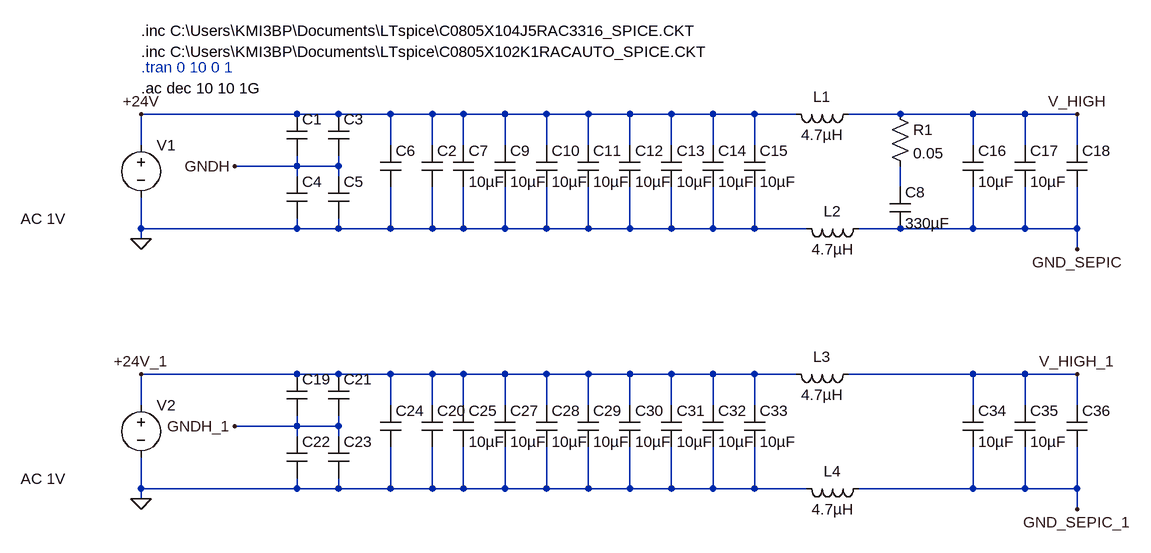
[diagram p0: schematic Draft1.asc]
Draft1.asc, the LTspice schematic file:
Version 4
SHEET 1 1584 900
WIRE 304 80 64 80
WIRE 368 80 304 80
WIRE 448 80 368 80
WIRE 512 80 448 80
WIRE 560 80 512 80
WIRE 624 80 560 80
WIRE 688 80 624 80
WIRE 752 80 688 80
WIRE 816 80 752 80
WIRE 880 80 816 80
WIRE 944 80 880 80
WIRE 1008 80 944 80
WIRE 1072 80 1008 80
WIRE 1232 80 1152 80
WIRE 1344 80 1232 80
WIRE 1424 80 1344 80
WIRE 1504 80 1424 80
WIRE 64 128 64 80
WIRE 448 128 448 80
WIRE 512 128 512 80
WIRE 560 128 560 80
WIRE 624 128 624 80
WIRE 688 128 688 80
WIRE 752 128 752 80
WIRE 816 128 816 80
WIRE 880 128 880 80
WIRE 944 128 944 80
WIRE 1008 128 1008 80
WIRE 1344 128 1344 80
WIRE 1424 128 1424 80
WIRE 1504 128 1504 80
WIRE 304 160 304 144
WIRE 304 160 208 160
WIRE 368 160 368 144
WIRE 368 160 304 160
WIRE 304 176 304 160
WIRE 368 176 368 160
WIRE 1232 192 1232 160
WIRE 64 256 64 208
WIRE 304 256 304 240
WIRE 304 256 64 256
WIRE 368 256 368 240
WIRE 368 256 304 256
WIRE 448 256 448 192
WIRE 448 256 368 256
WIRE 512 256 512 192
WIRE 512 256 448 256
WIRE 560 256 560 192
WIRE 560 256 512 256
WIRE 624 256 624 192
WIRE 624 256 560 256
WIRE 688 256 688 192
WIRE 688 256 624 256
WIRE 752 256 752 192
WIRE 752 256 688 256
WIRE 816 256 816 192
WIRE 816 256 752 256
WIRE 880 256 880 192
WIRE 880 256 816 256
WIRE 944 256 944 192
WIRE 944 256 880 256
WIRE 1008 256 1008 192
WIRE 1008 256 944 256
WIRE 1088 256 1008 256
WIRE 1232 256 1168 256
WIRE 1344 256 1344 192
WIRE 1344 256 1232 256
WIRE 1424 256 1424 192
WIRE 1424 256 1344 256
WIRE 1504 256 1504 192
WIRE 1504 256 1424 256
WIRE 64 272 64 256
WIRE 1504 288 1504 256
WIRE 304 480 64 480
WIRE 368 480 304 480
WIRE 448 480 368 480
WIRE 512 480 448 480
WIRE 560 480 512 480
WIRE 624 480 560 480
WIRE 688 480 624 480
WIRE 752 480 688 480
WIRE 816 480 752 480
WIRE 880 480 816 480
WIRE 944 480 880 480
WIRE 1008 480 944 480
WIRE 1072 480 1008 480
WIRE 1344 480 1152 480
WIRE 1424 480 1344 480
WIRE 1504 480 1424 480
WIRE 64 528 64 480
WIRE 448 528 448 480
WIRE 512 528 512 480
WIRE 560 528 560 480
WIRE 624 528 624 480
WIRE 688 528 688 480
WIRE 752 528 752 480
WIRE 816 528 816 480
WIRE 880 528 880 480
WIRE 944 528 944 480
WIRE 1008 528 1008 480
WIRE 1344 528 1344 480
WIRE 1424 528 1424 480
WIRE 1504 528 1504 480
WIRE 304 560 304 544
WIRE 304 560 208 560
WIRE 368 560 368 544
WIRE 368 560 304 560
WIRE 304 576 304 560
WIRE 368 576 368 560
WIRE 64 656 64 608
WIRE 304 656 304 640
WIRE 304 656 64 656
WIRE 368 656 368 640
WIRE 368 656 304 656
WIRE 448 656 448 592
WIRE 448 656 368 656
WIRE 512 656 512 592
WIRE 512 656 448 656
WIRE 560 656 560 592
WIRE 560 656 512 656
WIRE 624 656 624 592
WIRE 624 656 560 656
WIRE 688 656 688 592
WIRE 688 656 624 656
WIRE 752 656 752 592
WIRE 752 656 688 656
WIRE 816 656 816 592
WIRE 816 656 752 656
WIRE 880 656 880 592
WIRE 880 656 816 656
WIRE 944 656 944 592
WIRE 944 656 880 656
WIRE 1008 656 1008 592
WIRE 1008 656 944 656
WIRE 1088 656 1008 656
WIRE 1344 656 1344 592
WIRE 1344 656 1168 656
WIRE 1424 656 1424 592
WIRE 1424 656 1344 656
WIRE 1504 656 1504 592
WIRE 1504 656 1424 656
WIRE 64 672 64 656
WIRE 1504 688 1504 656
FLAG 208 160 GNDH
FLAG 64 272 0
FLAG 1504 288 GND_SEPIC
FLAG 1504 80 V_HIGH
FLAG 64 80 +24V
FLAG 208 560 GNDH_1
FLAG 64 672 0
FLAG 1504 688 GND_SEPIC_1
FLAG 1504 480 V_HIGH_1
FLAG 64 480 +24V_1
SYMBOL voltage 64 112 R0
WINDOW 3 -185 101 Left 2
WINDOW 123 -185 129 Left 2
WINDOW 39 0 0 Left 0
SYMATTR InstName V1
SYMATTR Value ""
SYMATTR Value2 AC 1V
SYMBOL cap 288 80 R0
WINDOW 3 24 56 Invisible 2
SYMATTR InstName C1
SYMATTR Value C0805X102K1RACAUTO
SYMATTR Prefix X
SYMBOL cap 496 128 R0
WINDOW 3 24 56 Invisible 2
SYMATTR InstName C2
SYMATTR Value C0805X104J5RAC3316
SYMATTR Prefix X
SYMBOL cap 352 80 R0
WINDOW 3 24 56 Invisible 2
SYMATTR InstName C3
SYMATTR Value C0805X102K1RACAUTO
SYMATTR Prefix X
SYMBOL cap 288 176 R0
WINDOW 3 24 56 Invisible 2
SYMATTR InstName C4
SYMATTR Value C0805X102K1RACAUTO
SYMATTR Prefix X
SYMBOL cap 352 176 R0
WINDOW 3 24 56 Invisible 2
SYMATTR InstName C5
SYMATTR Value C0805X102K1RACAUTO
SYMATTR Prefix X
SYMBOL cap 432 128 R0
WINDOW 3 24 56 Invisible 2
SYMATTR InstName C6
SYMATTR Value C0805X102K1RACAUTO
SYMATTR Prefix X
SYMBOL cap 544 128 R0
SYMATTR InstName C7
SYMATTR Value 10µF
SYMATTR SpiceLine V=50 Rser=2.2m Lser=0.6n Rpar=0.05G
SYMBOL ind 1168 64 R90
WINDOW 0 5 56 VBottom 2
WINDOW 3 32 56 VTop 2
SYMATTR InstName L1
SYMATTR Value 4.7µH
SYMATTR SpiceLine Rser=0.023 Rpar=6.2 Cpar=2.12pF
SYMBOL res 1216 64 R0
SYMATTR InstName R1
SYMATTR Value 0.05
SYMATTR SpiceLine tol=1 pwr=125m
SYMBOL cap 1216 192 R0
SYMATTR InstName C8
SYMATTR Value 330µF
SYMATTR SpiceLine V=50 Irms=600m Rser=230m
SYMBOL cap 608 128 R0
SYMATTR InstName C9
SYMATTR Value 10µF
SYMATTR SpiceLine V=50 Rser=2.2m Lser=0.6n Rpar=0.05G
SYMBOL cap 672 128 R0
SYMATTR InstName C10
SYMATTR Value 10µF
SYMATTR SpiceLine V=50 Rser=2.2m Lser=0.6n Rpar=0.05G
SYMBOL cap 736 128 R0
SYMATTR InstName C11
SYMATTR Value 10µF
SYMATTR SpiceLine V=50 Rser=2.2m Lser=0.6n Rpar=0.05G
SYMBOL cap 800 128 R0
SYMATTR InstName C12
SYMATTR Value 10µF
SYMATTR SpiceLine V=50 Rser=2.2m Lser=0.6n Rpar=0.05G
SYMBOL cap 864 128 R0
SYMATTR InstName C13
SYMATTR Value 10µF
SYMATTR SpiceLine V=50 Rser=2.2m Lser=0.6n Rpar=0.05G
SYMBOL cap 928 128 R0
SYMATTR InstName C14
SYMATTR Value 10µF
SYMATTR SpiceLine V=50 Rser=2.2m Lser=0.6n Rpar=0.05G
SYMBOL cap 992 128 R0
SYMATTR InstName C15
SYMATTR Value 10µF
SYMATTR SpiceLine V=50 Rser=2.2m Lser=0.6n Rpar=0.05G
SYMBOL ind 1184 240 R90
WINDOW 0 5 56 VBottom 2
WINDOW 3 32 56 VTop 2
SYMATTR InstName L2
SYMATTR Value 4.7µH
SYMATTR SpiceLine Rser=0.023 Rpar=6.2 Cpar=2.12pF
SYMBOL cap 1328 128 R0
SYMATTR InstName C16
SYMATTR Value 10µF
SYMATTR SpiceLine V=50 Rser=2.2m Lser=0.6n Rpar=0.05G
SYMBOL cap 1408 128 R0
SYMATTR InstName C17
SYMATTR Value 10µF
SYMATTR SpiceLine V=50 Rser=2.2m Lser=0.6n Rpar=0.05G
SYMBOL cap 1488 128 R0
WINDOW 3 24 56 Invisible 2
SYMATTR InstName C18
SYMATTR Value C0805X104J5RAC3316
SYMATTR Prefix X
SYMBOL voltage 64 512 R0
WINDOW 3 -185 101 Left 2
WINDOW 123 -185 129 Left 2
WINDOW 39 0 0 Left 0
SYMATTR InstName V2
SYMATTR Value ""
SYMATTR Value2 AC 1V
SYMBOL cap 288 480 R0
WINDOW 3 24 56 Invisible 2
SYMATTR InstName C19
SYMATTR Value C0805X102K1RACAUTO
SYMATTR Prefix X
SYMBOL cap 496 528 R0
WINDOW 3 24 56 Invisible 2
SYMATTR InstName C20
SYMATTR Value C0805X104J5RAC3316
SYMATTR Prefix X
SYMBOL cap 352 480 R0
WINDOW 3 24 56 Invisible 2
SYMATTR InstName C21
SYMATTR Value C0805X102K1RACAUTO
SYMATTR Prefix X
SYMBOL cap 288 576 R0
WINDOW 3 24 56 Invisible 2
SYMATTR InstName C22
SYMATTR Value C0805X102K1RACAUTO
SYMATTR Prefix X
SYMBOL cap 352 576 R0
WINDOW 3 24 56 Invisible 2
SYMATTR InstName C23
SYMATTR Value C0805X102K1RACAUTO
SYMATTR Prefix X
SYMBOL cap 432 528 R0
WINDOW 3 24 56 Invisible 2
SYMATTR InstName C24
SYMATTR Value C0805X102K1RACAUTO
SYMATTR Prefix X
SYMBOL cap 544 528 R0
SYMATTR InstName C25
SYMATTR Value 10µF
SYMATTR SpiceLine V=50 Rser=2.2m Lser=0.6n Rpar=0.05G
SYMBOL ind 1168 464 R90
WINDOW 0 5 56 VBottom 2
WINDOW 3 32 56 VTop 2
SYMATTR InstName L3
SYMATTR Value 4.7µH
SYMATTR SpiceLine Rser=0.023 Rpar=6.2 Cpar=2.12pF
SYMBOL cap 608 528 R0
SYMATTR InstName C27
SYMATTR Value 10µF
SYMATTR SpiceLine V=50 Rser=2.2m Lser=0.6n Rpar=0.05G
SYMBOL cap 672 528 R0
SYMATTR InstName C28
SYMATTR Value 10µF
SYMATTR SpiceLine V=50 Rser=2.2m Lser=0.6n Rpar=0.05G
SYMBOL cap 736 528 R0
SYMATTR InstName C29
SYMATTR Value 10µF
SYMATTR SpiceLine V=50 Rser=2.2m Lser=0.6n Rpar=0.05G
SYMBOL cap 800 528 R0
SYMATTR InstName C30
SYMATTR Value 10µF
SYMATTR SpiceLine V=50 Rser=2.2m Lser=0.6n Rpar=0.05G
SYMBOL cap 864 528 R0
SYMATTR InstName C31
SYMATTR Value 10µF
SYMATTR SpiceLine V=50 Rser=2.2m Lser=0.6n Rpar=0.05G
SYMBOL cap 928 528 R0
SYMATTR InstName C32
SYMATTR Value 10µF
SYMATTR SpiceLine V=50 Rser=2.2m Lser=0.6n Rpar=0.05G
SYMBOL cap 992 528 R0
SYMATTR InstName C33
SYMATTR Value 10µF
SYMATTR SpiceLine V=50 Rser=2.2m Lser=0.6n Rpar=0.05G
SYMBOL ind 1184 640 R90
WINDOW 0 5 56 VBottom 2
WINDOW 3 32 56 VTop 2
SYMATTR InstName L4
SYMATTR Value 4.7µH
SYMATTR SpiceLine Rser=0.023 Rpar=6.2 Cpar=2.12pF
SYMBOL cap 1328 528 R0
SYMATTR InstName C34
SYMATTR Value 10µF
SYMATTR SpiceLine V=50 Rser=2.2m Lser=0.6n Rpar=0.05G
SYMBOL cap 1408 528 R0
SYMATTR InstName C35
SYMATTR Value 10µF
SYMATTR SpiceLine V=50 Rser=2.2m Lser=0.6n Rpar=0.05G
SYMBOL cap 1488 528 R0
WINDOW 3 24 56 Invisible 2
SYMATTR InstName C36
SYMATTR Value C0805X104J5RAC3316
SYMATTR Prefix X
TEXT 64 -48 Left 2 !.inc C:\\Users\\KMI3BP\\Documents\\LTspice\\C0805X104J5RAC3316_SPICE.CKT
TEXT 64 -16 Left 2 !.inc C:\\Users\\KMI3BP\\Documents\\LTspice\\C0805X102K1RACAUTO_SPICE.CKT
TEXT 64 8 Left 2 ;.tran 0 10 0 1
TEXT 64 40 Left 2 !.ac dec 10 10 1G

The netlist it stands for:
* Draft1.asc
V1 +24V 0 AC 1V
XC1 +24V GNDH C0805X102K1RACAUTO  ; pins A B
XC2 +24V 0 C0805X104J5RAC3316  ; pins A B
XC3 +24V GNDH C0805X102K1RACAUTO  ; pins A B
XC4 GNDH 0 C0805X102K1RACAUTO  ; pins A B
XC5 GNDH 0 C0805X102K1RACAUTO  ; pins A B
XC6 +24V 0 C0805X102K1RACAUTO  ; pins A B
C7 +24V 0 10µF V=50 Rser=2.2m Lser=0.6n Rpar=0.05G
L1 V_HIGH +24V 4.7µH Rser=0.023 Rpar=6.2 Cpar=2.12pF
R1 V_HIGH N001 0.05 tol=1 pwr=125m
C8 N001 GND_SEPIC 330µF V=50 Irms=600m Rser=230m
C9 +24V 0 10µF V=50 Rser=2.2m Lser=0.6n Rpar=0.05G
C10 +24V 0 10µF V=50 Rser=2.2m Lser=0.6n Rpar=0.05G
C11 +24V 0 10µF V=50 Rser=2.2m Lser=0.6n Rpar=0.05G
C12 +24V 0 10µF V=50 Rser=2.2m Lser=0.6n Rpar=0.05G
C13 +24V 0 10µF V=50 Rser=2.2m Lser=0.6n Rpar=0.05G
C14 +24V 0 10µF V=50 Rser=2.2m Lser=0.6n Rpar=0.05G
C15 +24V 0 10µF V=50 Rser=2.2m Lser=0.6n Rpar=0.05G
L2 GND_SEPIC 0 4.7µH Rser=0.023 Rpar=6.2 Cpar=2.12pF
C16 V_HIGH GND_SEPIC 10µF V=50 Rser=2.2m Lser=0.6n Rpar=0.05G
C17 V_HIGH GND_SEPIC 10µF V=50 Rser=2.2m Lser=0.6n Rpar=0.05G
XC18 V_HIGH GND_SEPIC C0805X104J5RAC3316  ; pins A B
V2 +24V_1 0 AC 1V
XC19 +24V_1 GNDH_1 C0805X102K1RACAUTO  ; pins A B
XC20 +24V_1 0 C0805X104J5RAC3316  ; pins A B
XC21 +24V_1 GNDH_1 C0805X102K1RACAUTO  ; pins A B
XC22 GNDH_1 0 C0805X102K1RACAUTO  ; pins A B
XC23 GNDH_1 0 C0805X102K1RACAUTO  ; pins A B
XC24 +24V_1 0 C0805X102K1RACAUTO  ; pins A B
C25 +24V_1 0 10µF V=50 Rser=2.2m Lser=0.6n Rpar=0.05G
L3 V_HIGH_1 +24V_1 4.7µH Rser=0.023 Rpar=6.2 Cpar=2.12pF
C27 +24V_1 0 10µF V=50 Rser=2.2m Lser=0.6n Rpar=0.05G
C28 +24V_1 0 10µF V=50 Rser=2.2m Lser=0.6n Rpar=0.05G
C29 +24V_1 0 10µF V=50 Rser=2.2m Lser=0.6n Rpar=0.05G
C30 +24V_1 0 10µF V=50 Rser=2.2m Lser=0.6n Rpar=0.05G
C31 +24V_1 0 10µF V=50 Rser=2.2m Lser=0.6n Rpar=0.05G
C32 +24V_1 0 10µF V=50 Rser=2.2m Lser=0.6n Rpar=0.05G
C33 +24V_1 0 10µF V=50 Rser=2.2m Lser=0.6n Rpar=0.05G
L4 GND_SEPIC_1 0 4.7µH Rser=0.023 Rpar=6.2 Cpar=2.12pF
C34 V_HIGH_1 GND_SEPIC_1 10µF V=50 Rser=2.2m Lser=0.6n Rpar=0.05G
C35 V_HIGH_1 GND_SEPIC_1 10µF V=50 Rser=2.2m Lser=0.6n Rpar=0.05G
XC36 V_HIGH_1 GND_SEPIC_1 C0805X104J5RAC3316  ; pins A B
.inc C:\Users\KMI3BP\Documents\LTspice\C0805X104J5RAC3316_SPICE.CKT
.inc C:\Users\KMI3BP\Documents\LTspice\C0805X102K1RACAUTO_SPICE.CKT
* .tran 0 10 0 1
.ac dec 10 10 1G
.backanno
.end